# EAGLE design Puzzle I2C hub (EAGLE 6.2)
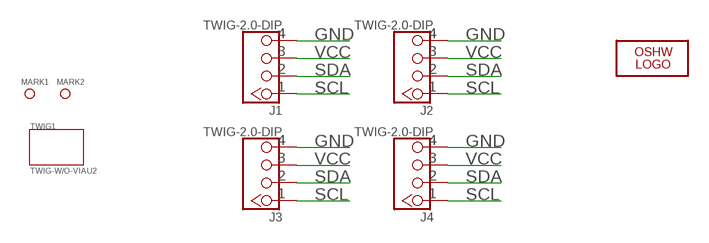
[diagram p0: schematic, sheet 1]

## Parts
J1  TWIG-2.0-DIP  [2.0_1X4]
J2  TWIG-2.0-DIP  [2.0_1X4]
J3  TWIG-2.0-DIP  [2.0_1X4]
J4  TWIG-2.0-DIP  [2.0_1X4]
LOGO3  LOGO-OSHW-FILLX0150-NT  [OSHW_FILLX150_NOTEXT]
MARK1  PAD-MARK  [MARK]
MARK2  PAD-MARK  [MARK]
TWIG1  TWIG-W/O-VIAU2  [U2N]

## Nets
GND: J1.4 J2.4 J3.4 J4.4
SCL: J1.1 J2.1 J3.1 J4.1
SDA: J1.2 J2.2 J3.2 J4.2
VCC: J1.3 J2.3 J3.3 J4.3

## Library data of the parts
J1-J4 = Connector:TWIG-2.0-DIP
LOGO3 = Logo:LOGO-OSHW-FILL
MARK1 MARK2 = Discrete:PAD-MARK
TWIG1 = Module:TWIG-W/O-VIA

## Board
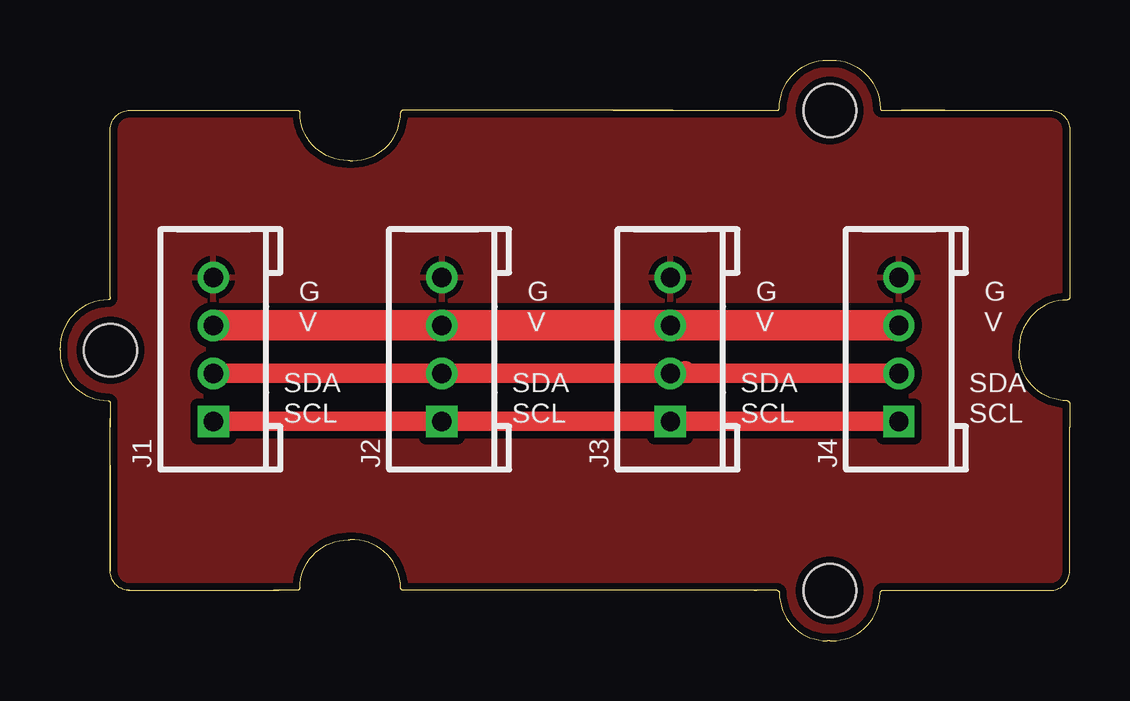
[diagram p1: board, top side]
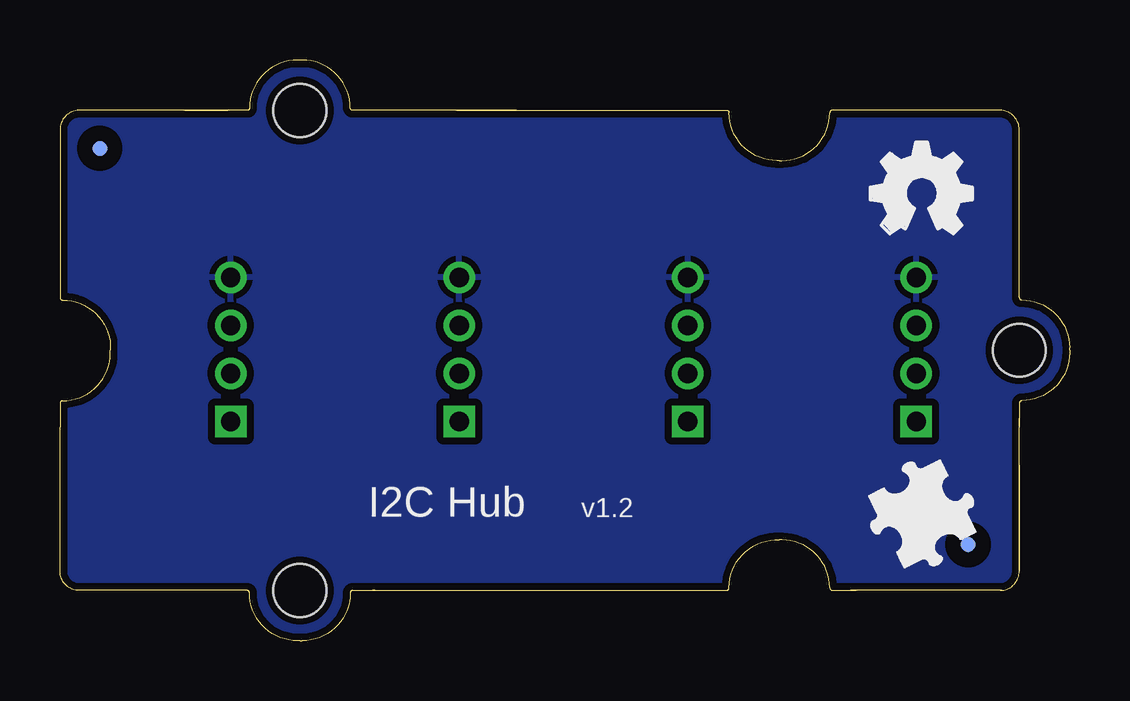
[diagram p2: board, bottom side, seen from below]

Size 42.09 x 24.2 mm. Coordinates in mm from the lower left corner, seen from the top.
Copper layers (1*16): Top 0.035mm / dielectric 1.5mm / Bottom 0.035mm
Design rules: minimum track width 6mil, minimum drill 12mil, track to track 6mil, track to pad 6mil, pad to pad 6mil, via to via 6mil, smd to smd 0mil, copper to edge 10mil, drill to drill 10mil, minimum pad ring 10mil, minimum via ring 6mil, stop-mask expansion 2mil, vias tented up to drill 100mil, thermal gap 10mil

### Footprints (pad centres in the part's own frame; a part is rotated, then mirrored left to right if it is on the bottom)
2.0_1X4 = drill 0.8 pad 1.27 square: 1 -3,0 | drill 0.8 pad 1.27: 2 -1,0; 3 1,0; 4 3,0
MARK = smd 0.635 x 0.635: P$1 0,0
U2N = hole 2.2: 10.453,-10.42; 10.453,9.58; -19.535,-0.415

### Placement (x,y rotation side)
J1  6.4,12.14 90 top
J2  15.92,12.14 90 top
J3  25.45,12.14 90 top
J4  34.97,12.14 90 top
LOGO3  8.3,16.96 0 bottom
MARK1  4.24,4.01 0 bottom
MARK2  40.43,20.52 0 bottom
TWIG1  21.64,12.52 0 top
U$2  [BRICK-LOGO-MIL-0.5]  8.68,2.74 0 bottom

### Tracks (layer width: path | path; a pad name or v marks a point on that pad's centre or on a via)
GND
  pour Bottom (isolate 0.305): 41.95,-0.18 0.05,-0.18 0.05,24.58 41.95,24.58
  pour Top (isolate 0.305): 41.95,-0.18 0.05,-0.18 0.05,24.58 41.95,24.58
SCL
  Top 0.813: J1.1 J2.1 J3.1 J4.1
SDA
  Top 0.813: J1.2 J2.2 J3.2 | J3.2 26.08,11.25 J3.2 | J3.2 J4.2
VCC
  Top 1.27: J1.3 J2.3 J3.3 J4.3

### Text on the board
tPlace: G | G | G | G | V | V | V | V | SDA | SDA | SDA | SDA | SCL | SCL | SCL | SCL
bPlace: v1.2 | I2C Hub